# EAGLE design the staff #2 (EAGLE 7.1.0)
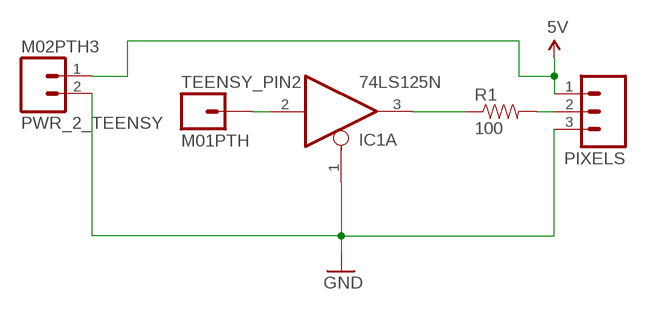
[diagram p0: schematic, sheet 1]

## Parts
IC1  74LS125N  [DIL14]
PIXELS  M03LONGPADS  [1X03_LONGPADS]
PWR_2_TEENSY  M02PTH3  [1X02_LONGPADS]
R1  100  RESISTORPTH-1/4W  [AXIAL-0.4]
TEENSY_PIN2  M01PTH  [1X01]

## Nets
GND: IC1.1(A:OE) PIXELS.3 PWR_2_TEENSY.2
N$1: IC1.3(A:O) R1.P$1
N$2: PIXELS.2 R1.P$2
N$3: IC1.2(A:I) TEENSY_PIN2.1
VCC: PIXELS.1 PWR_2_TEENSY.1 ; supply symbol labelled 5V
Unconnected: IC1.4(B:OE) IC1.5(B:I) IC1.6(B:O) IC1.8(C:O) IC1.9(C:I) IC1.10(C:OE) IC1.11(D:O) IC1.12(D:I) IC1.13(D:OE)

## Power pins joined to a net without a drawn wire
GND: IC1.7(P:GND)
VCC: IC1.14(P:VCC)

## Library data of the parts
IC1 = adafruit:74*125: Quad bus BUFFER, 3-state
PIXELS = SparkFun-Connectors:M03: Header 3 Standard 3-pin 0.1" header. Use with straight break away headers (SKU : PRT-00116), right angle break away headers (PRT-00553), swiss pins (PRT-00743), machine pins (PRT-00117), and female headers (PRT-00115). Molex polarized connector foot print use with SKU : PRT-08232 with associated crimp pins and housings.
PWR_2_TEENSY = SparkFun-Connectors:M02: Standard 2-pin 0.1" header. Use with - straight break away headers ( PRT-00116) - right angle break away headers (PRT-00553) - swiss pins (PRT-00743) - machine pins (PRT-00117) - female headers (PRT-00115) Molex polarized connector foot print use with: PRT-08233 with associated crimp pins and housings. 2.54_SCREWTERM for use with PRT-10571. 3.5mm Screw Terminal footprints for PRT-08084 5mm Screw Terminal footprints for use with PRT-08433
R1 = SparkFun-Passives:RESISTOR: Resistor Basic schematic elements and footprints for 0603, 1206, and PTH resistors.
TEENSY_PIN2 = SparkFun-Connectors:M01: Header 1 Standard 1-pin 0.1" header. Use with straight break away headers (SKU : PRT-00116), right angle break away headers (PRT-00553), swiss pins (PRT-00743), machine pins (PRT-00117), and female headers (PRT-00115).

## Board
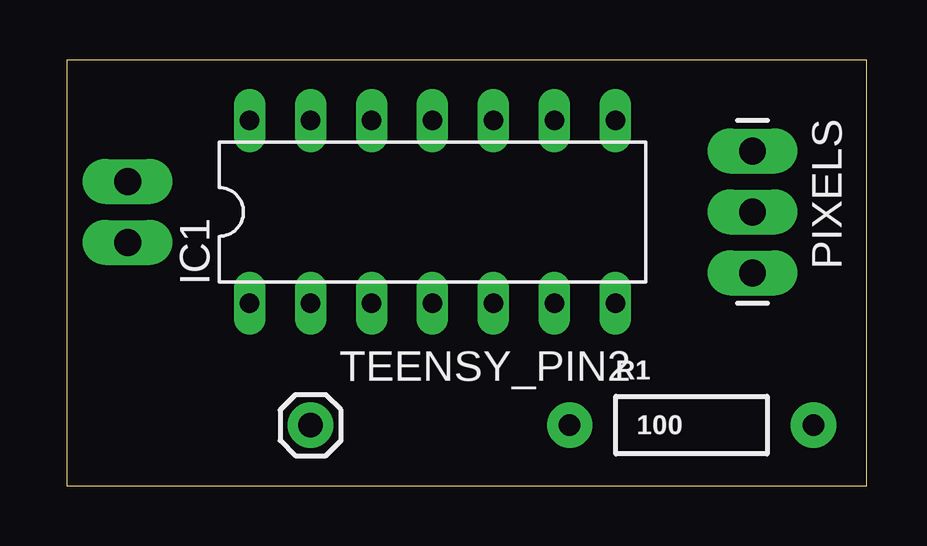
[diagram p1: board, top side]
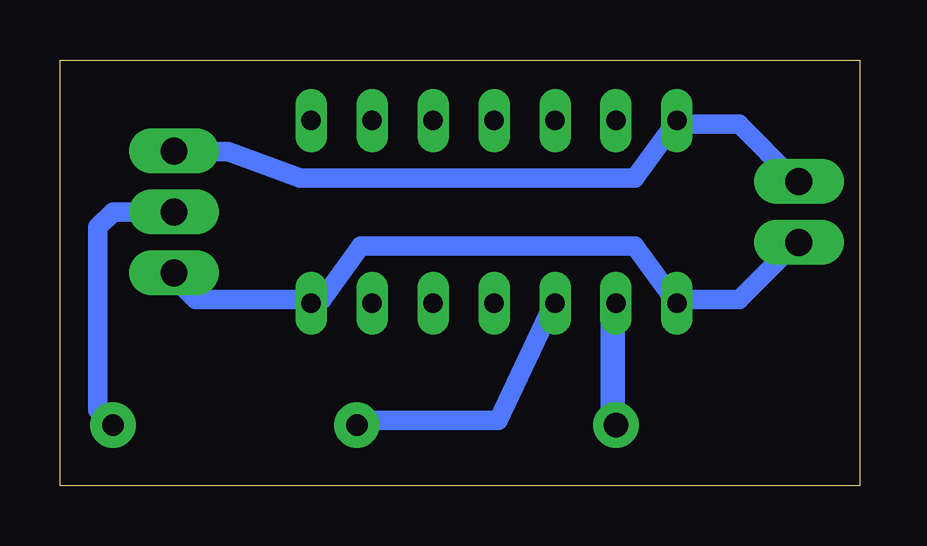
[diagram p2: board, bottom side, seen from below]

Size 33.33 x 17.77 mm. Coordinates in mm from the lower left corner, seen from the top.
Outline: 0,0 33.33,0 33.33,17.77 0,17.77 0,0
Copper layers (1*16): Top 0.035mm / dielectric 1.5mm / Bottom 0.035mm
Design rules "default": minimum track width 10mil, minimum drill 24mil, track to track 8mil, track to pad 8mil, pad to pad 8mil, via to via 8mil, smd to smd 8mil, copper to edge 40mil, drill to drill 8mil, minimum pad ring 10mil, minimum via ring 8mil, stop-mask expansion 4mil, vias tented up to drill 0mil, thermal gap 10mil

### Footprints (pad centres in the part's own frame; a part is rotated, then mirrored left to right if it is on the bottom)
DIL14 = drill 0.813 long: 1 -7.62,-3.81; 2 -5.08,-3.81; 3 -2.54,-3.81; 4 0,-3.81; 5 2.54,-3.81; 6 5.08,-3.81; 7 7.62,-3.81; 8 7.62,3.81; 9 5.08,3.81; 10 2.54,3.81; 11 0,3.81; 12 -2.54,3.81; 13 -5.08,3.81; 14 -7.62,3.81
1X03_LONGPADS = drill 1.118 pad 1.88 long: 1 0,0; 2 2.54,0; 3 5.08,0
1X02_LONGPADS = drill 1.118 pad 1.88 long: 1 0,0; 2 2.54,0
AXIAL-0.4 = drill 0.9 pad 1.88: P$1 -5.08,0; P$2 5.08,0
1X01 = drill 1.016 pad 1.88: 1 0,0

### Placement (x,y rotation side)
IC1  15.24,11.43 0 top
PIXELS  28.57,13.97 270 top
PWR_2_TEENSY  2.54,12.7 270 top
R1  26.04,2.54 0 top
TEENSY_PIN2  10.16,2.54 0 top

### Tracks (layer width: path | path; a pad name or v marks a point on that pad's centre or on a via)
GND
  Bottom 0.254: 28.57,8.69 PIXELS.3 | 7.54,7.77 IC1.1 | 2.74,10.06 PWR_2_TEENSY.2 | 22.4,7.77 22.86,7.77 IC1.7
  Bottom 0.813: 22.86,7.77 27.66,7.77 28.57,8.69 | 7.54,7.77 5.03,7.77 2.74,10.06 | 22.4,7.77 20.8,10.01 9.37,10.01 IC1.1
N$1
  Bottom 0.254: 12.8,7.54 IC1.3 | 20.8,2.74 R1.P$1
  Bottom 0.813: 12.8,7.54 15.06,2.74 20.8,2.74
N$2
  Bottom 0.813: PIXELS.2 31.11,11.43 31.75,10.79 31.75,3.17 R1.P$2
N$3
  Bottom 0.254: 10.29,7.54 IC1.2 | 10.29,2.74 TEENSY_PIN2.1
  Bottom 1.016: 10.29,2.74 10.29,7.54
VCC
  Bottom 0.254: 7.54,15.09 IC1.14 | 2.74,12.8 PWR_2_TEENSY.1 | 28.57,13.95 PIXELS.1
  Bottom 0.813: 7.54,15.09 5.03,15.09 2.74,12.8 | 28.57,13.95 26.31,13.95 23.32,12.85 9.37,12.85 IC1.14